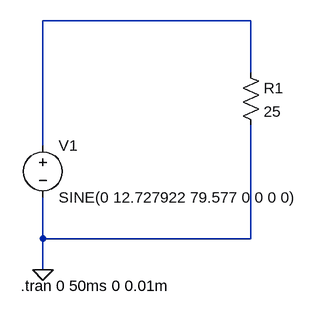
[diagram p0: schematic scheme1.asc]
scheme1.asc, the LTspice schematic file:
Version 4
SHEET 1 880 680
WIRE 496 -48 176 -48
WIRE 496 32 496 -48
WIRE 176 144 176 -48
WIRE 176 288 176 224
WIRE 496 288 496 112
WIRE 496 288 176 288
WIRE 176 336 176 288
FLAG 176 336 0
SYMBOL voltage 176 128 R0
WINDOW 123 0 0 Left 0
WINDOW 39 0 0 Left 0
SYMATTR InstName V1
SYMATTR Value SINE(0 12.727922 79.577 0 0 0 0)
SYMBOL res 480 16 R0
SYMATTR InstName R1
SYMATTR Value 25
TEXT 142 360 Left 2 !.tran 0 50ms 0 0.01m

The netlist it stands for:
* scheme1.asc
V1 N001 0 SINE(0 12.727922 79.577 0 0 0 0)
R1 N001 0 25
.tran 0 50ms 0 0.01m
.backanno
.end